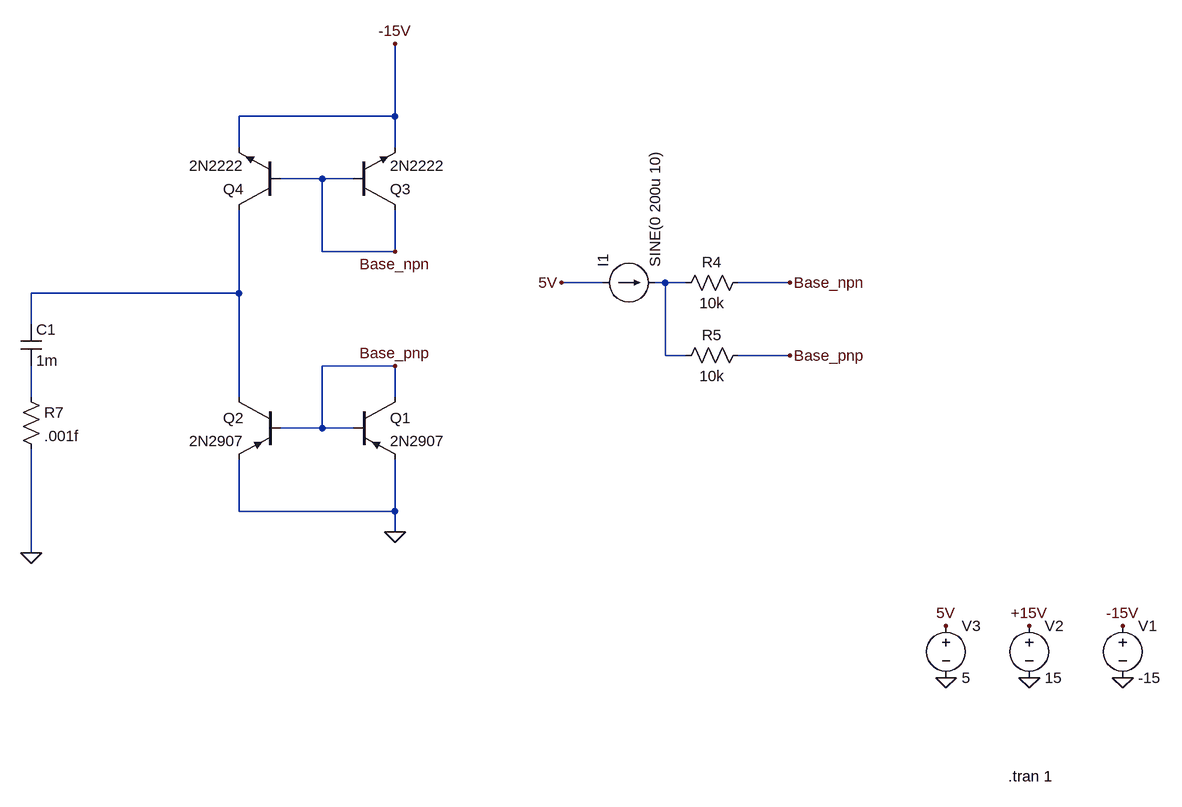
[diagram p0: schematic Draft2.asc]
Draft2.asc, the LTspice schematic file:
Version 4.1
SHEET 1 892 680
WIRE -1280 -624 -1280 -736
WIRE -1280 -624 -1520 -624
WIRE -1520 -576 -1520 -624
WIRE -1280 -576 -1280 -624
WIRE -1392 -528 -1456 -528
WIRE -1344 -528 -1392 -528
WIRE -1392 -416 -1392 -528
WIRE -1280 -416 -1280 -480
WIRE -1280 -416 -1392 -416
WIRE -960 -368 -1024 -368
WIRE -864 -368 -880 -368
WIRE -832 -368 -864 -368
WIRE -672 -368 -752 -368
WIRE -1520 -352 -1520 -480
WIRE -1520 -352 -1840 -352
WIRE -1840 -304 -1840 -352
WIRE -864 -256 -864 -368
WIRE -832 -256 -864 -256
WIRE -672 -256 -752 -256
WIRE -1280 -240 -1392 -240
WIRE -1840 -192 -1840 -240
WIRE -1520 -192 -1520 -352
WIRE -1280 -192 -1280 -240
WIRE -1392 -144 -1392 -240
WIRE -1392 -144 -1456 -144
WIRE -1344 -144 -1392 -144
WIRE -1520 -16 -1520 -96
WIRE -1280 -16 -1280 -96
WIRE -1280 -16 -1520 -16
WIRE -1280 16 -1280 -16
WIRE -1840 48 -1840 -112
FLAG -160 240 0
FLAG -304 240 0
FLAG -304 160 +15V
FLAG -160 160 -15V
FLAG -432 240 0
FLAG -432 160 5V
FLAG -1280 16 0
FLAG -1280 -736 -15V
FLAG -672 -368 Base_npn
FLAG -1024 -368 5V
FLAG -672 -256 Base_pnp
FLAG -1840 48 0
FLAG -1280 -416 Base_npn
FLAG -1280 -240 Base_pnp
SYMBOL current -960 -368 R270
WINDOW 123 0 0 Left 0
WINDOW 39 0 0 Left 0
SYMATTR InstName I1
SYMATTR Value SINE(0 200u 10)
SYMBOL voltage -160 144 R0
WINDOW 123 0 0 Left 0
WINDOW 39 0 0 Left 0
SYMATTR InstName V1
SYMATTR Value -15
SYMBOL voltage -304 144 R0
WINDOW 123 0 0 Left 0
WINDOW 39 0 0 Left 0
SYMATTR InstName V2
SYMATTR Value 15
SYMBOL voltage -432 144 R0
WINDOW 123 0 0 Left 0
WINDOW 39 0 0 Left 0
SYMATTR InstName V3
SYMATTR Value 5
SYMBOL res -848 -352 R270
WINDOW 0 32 56 VTop 2
WINDOW 3 0 56 VBottom 2
SYMATTR InstName R4
SYMATTR Value 10k
SYMBOL res -848 -240 R270
WINDOW 0 32 56 VTop 2
WINDOW 3 0 56 VBottom 2
SYMATTR InstName R5
SYMATTR Value 10k
SYMBOL res -1856 -208 R0
SYMATTR InstName R7
SYMATTR Value .001f
SYMBOL pnp -1344 -192 R0
SYMATTR InstName Q1
SYMATTR Value 2N2907
SYMBOL pnp -1456 -192 M0
SYMATTR InstName Q2
SYMATTR Value 2N2907
SYMBOL npn -1344 -480 M180
SYMATTR InstName Q3
SYMATTR Value 2N2222
SYMBOL npn -1456 -480 R180
SYMATTR InstName Q4
SYMATTR Value 2N2222
SYMBOL cap -1856 -304 R0
SYMATTR InstName C1
SYMATTR Value 1m
TEXT -336 392 Left 2 !.tran 1

The netlist it stands for:
* Draft2.asc
I1 5V N001 SINE(0 200u 10)
V1 -15V 0 -15
V2 +15V 0 15
V3 5V 0 5
R4 N001 Base_npn 10k
R5 N001 Base_pnp 10k
R7 N003 0 .001f
Q1 Base_pnp Base_pnp 0 0 2N2907
Q2 N002 Base_pnp 0 0 2N2907
Q3 Base_npn Base_npn -15V 0 2N2222
Q4 N002 Base_npn -15V 0 2N2222
C1 N002 N003 1m
.model NPN NPN
.model PNP PNP
.lib standard.bjt
.tran 1
.backanno
.end